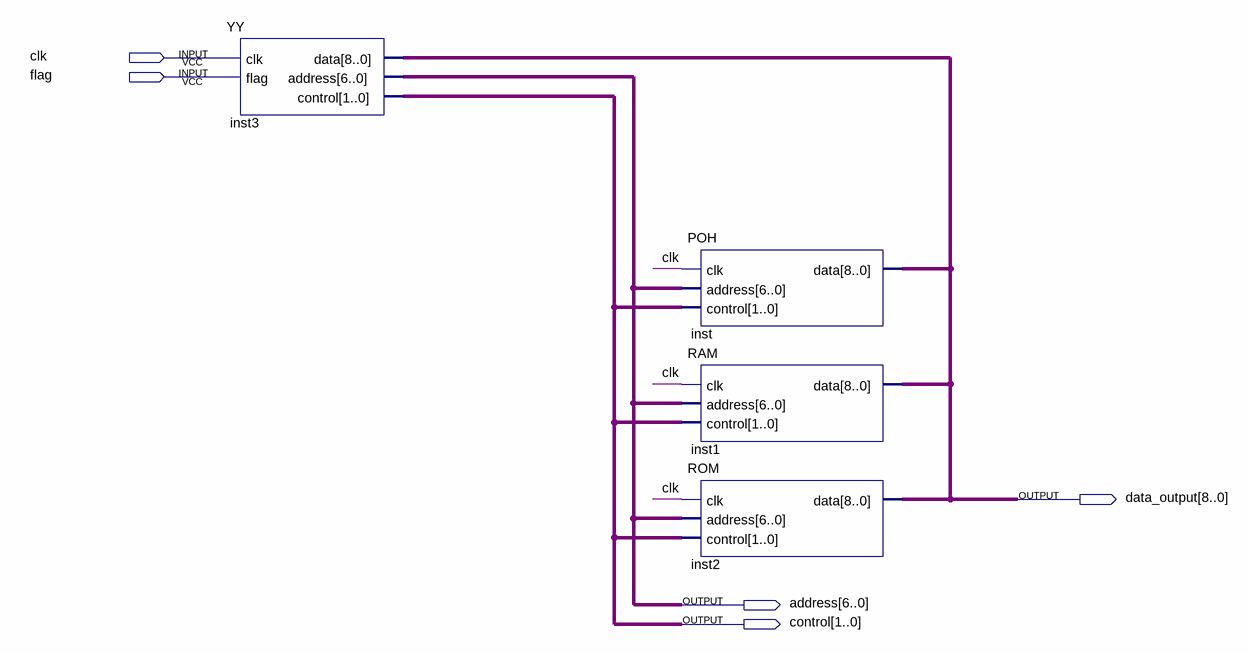
[diagram p0: schematic sheet]
// Quartus schematic MainBlock.bdf as structural Verilog: 4 symbols, 5 pins
module MainBlock (
  input  clk,
  input  flag,
  output [8:0] data_output,
  output [6:0] address,
  output [1:0] control
);

  YY inst3 (.clk(clk), .flag(flag), .address(address), .control(control), .data(data_output));
  POH inst (.clk(clk), .address(address), .control(control), .data(data_output));
  RAM inst1 (.clk(clk), .address(address), .control(control), .data(data_output));
  ROM inst2 (.clk(clk), .address(address), .control(control), .data(data_output));
endmodule
